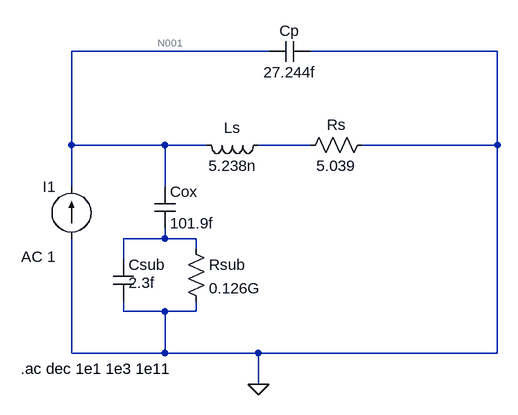
[diagram p0: schematic Hexa.asc]
Hexa.asc, the LTspice schematic file:
Version 4
SHEET 1 880 680
WIRE 240 -48 -64 -48
WIRE 592 -48 304 -48
WIRE -64 96 -64 -48
WIRE 80 96 -64 96
WIRE 144 96 80 96
WIRE 304 96 224 96
WIRE 592 96 592 -48
WIRE 592 96 384 96
WIRE -64 160 -64 96
WIRE 80 160 80 96
WIRE 80 240 80 224
WIRE 80 240 16 240
WIRE 128 240 80 240
WIRE 128 256 128 240
WIRE 16 272 16 240
WIRE 16 352 16 336
WIRE 80 352 16 352
WIRE 128 352 128 336
WIRE 128 352 80 352
WIRE -64 416 -64 240
WIRE 80 416 80 352
WIRE 80 416 -64 416
WIRE 224 416 80 416
WIRE 592 416 592 96
WIRE 592 416 224 416
WIRE 224 464 224 416
FLAG 224 464 0
SYMBOL current -64 240 R180
WINDOW 0 24 80 Left 2
WINDOW 3 24 0 Left 2
WINDOW 123 24 -28 Left 2
WINDOW 39 0 0 Left 0
SYMATTR InstName I1
SYMATTR Value ""
SYMATTR Value2 AC 1
SYMBOL ind 240 80 R90
WINDOW 0 5 56 VBottom 2
WINDOW 3 32 56 VTop 2
SYMATTR InstName Ls
SYMATTR Value 5.238n
SYMBOL cap 304 -64 R90
WINDOW 0 0 32 VBottom 2
WINDOW 3 32 32 VTop 2
SYMATTR InstName Cp
SYMATTR Value 27.244f
SYMBOL res 400 80 R90
WINDOW 0 0 56 VBottom 2
WINDOW 3 32 56 VTop 2
SYMATTR InstName Rs
SYMATTR Value 5.039
SYMBOL cap 64 160 R0
SYMATTR InstName Cox
SYMATTR Value 101.9f
SYMBOL cap 0 272 R0
WINDOW 3 24 36 Left 2
SYMATTR InstName Csub
SYMATTR Value 2.3f
SYMBOL res 112 240 R0
SYMATTR InstName Rsub
SYMATTR Value 0.126G
TEXT -142 440 Left 2 !.ac dec 1e1 1e3 1e11

The netlist it stands for:
* Hexa.asc
I1 0 N001 AC 1
Ls N002 N001 5.238n
Cp 0 N001 27.244f
Rs 0 N002 5.039
Cox N001 N003 101.9f
Csub N003 0 2.3f
Rsub N003 0 0.126G
.ac dec 1e1 1e3 1e11
.backanno
.end

* Results of the author's LTspice run, read from the files saved beside the schematic
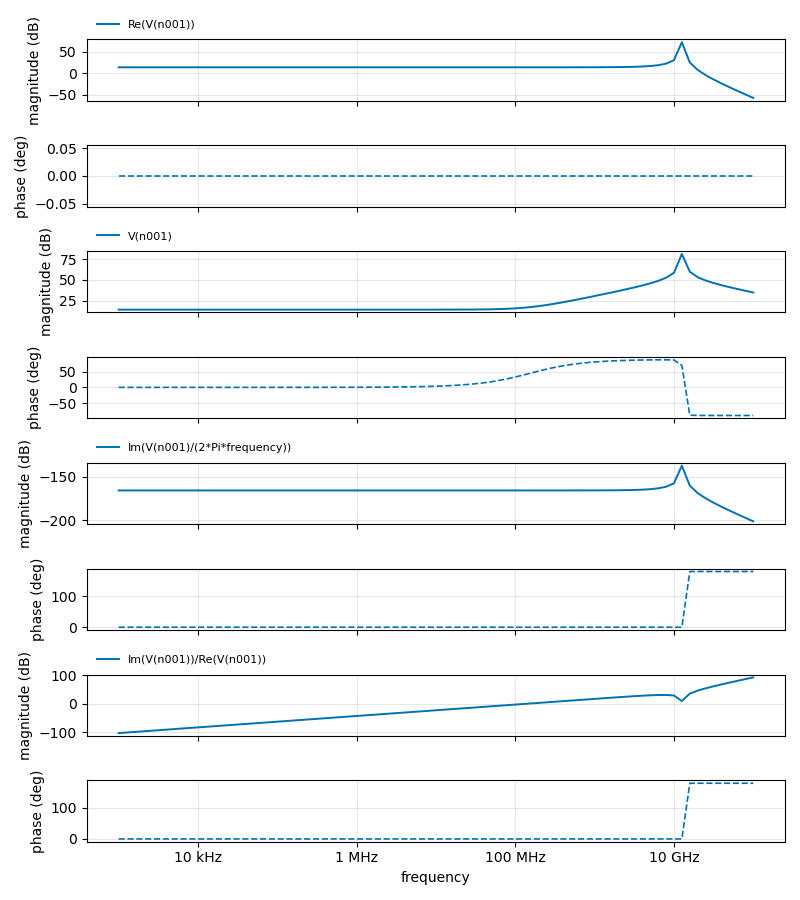
[diagram p1: AC Analysis of Hexa.asc, plotted from the saved traces]
* AC Analysis, 1 run:
*   Re(V(n001)): 14.05 dB at 1 kHz, -56.93 dB at 100 GHz, peak 72.09 dB at 12.59 GHz, 3 dB below the peak at 12.38 GHz and 12.78 GHz
*   V(n001): 14.05 dB at 1 kHz, 34.79 dB at 100 GHz, peak 81.37 dB at 12.59 GHz, 3 dB below the peak at 12.21 GHz and 13 GHz
*   Im(V(n001)/(2*Pi*frequency)): -165.62 dB at 1 kHz, -201.18 dB at 100 GHz, peak -137.14 dB at 12.59 GHz, 3 dB below the peak at 12.17 GHz and 12.97 GHz
*   Im(V(n001))/Re(V(n001)): -103.71 dB at 1 kHz, 91.72 dB at 100 GHz, peak 91.72 dB at 100 GHz, 3 dB below the peak at 89.15 GHz